# EAGLE design mint (EAGLE 6.4)
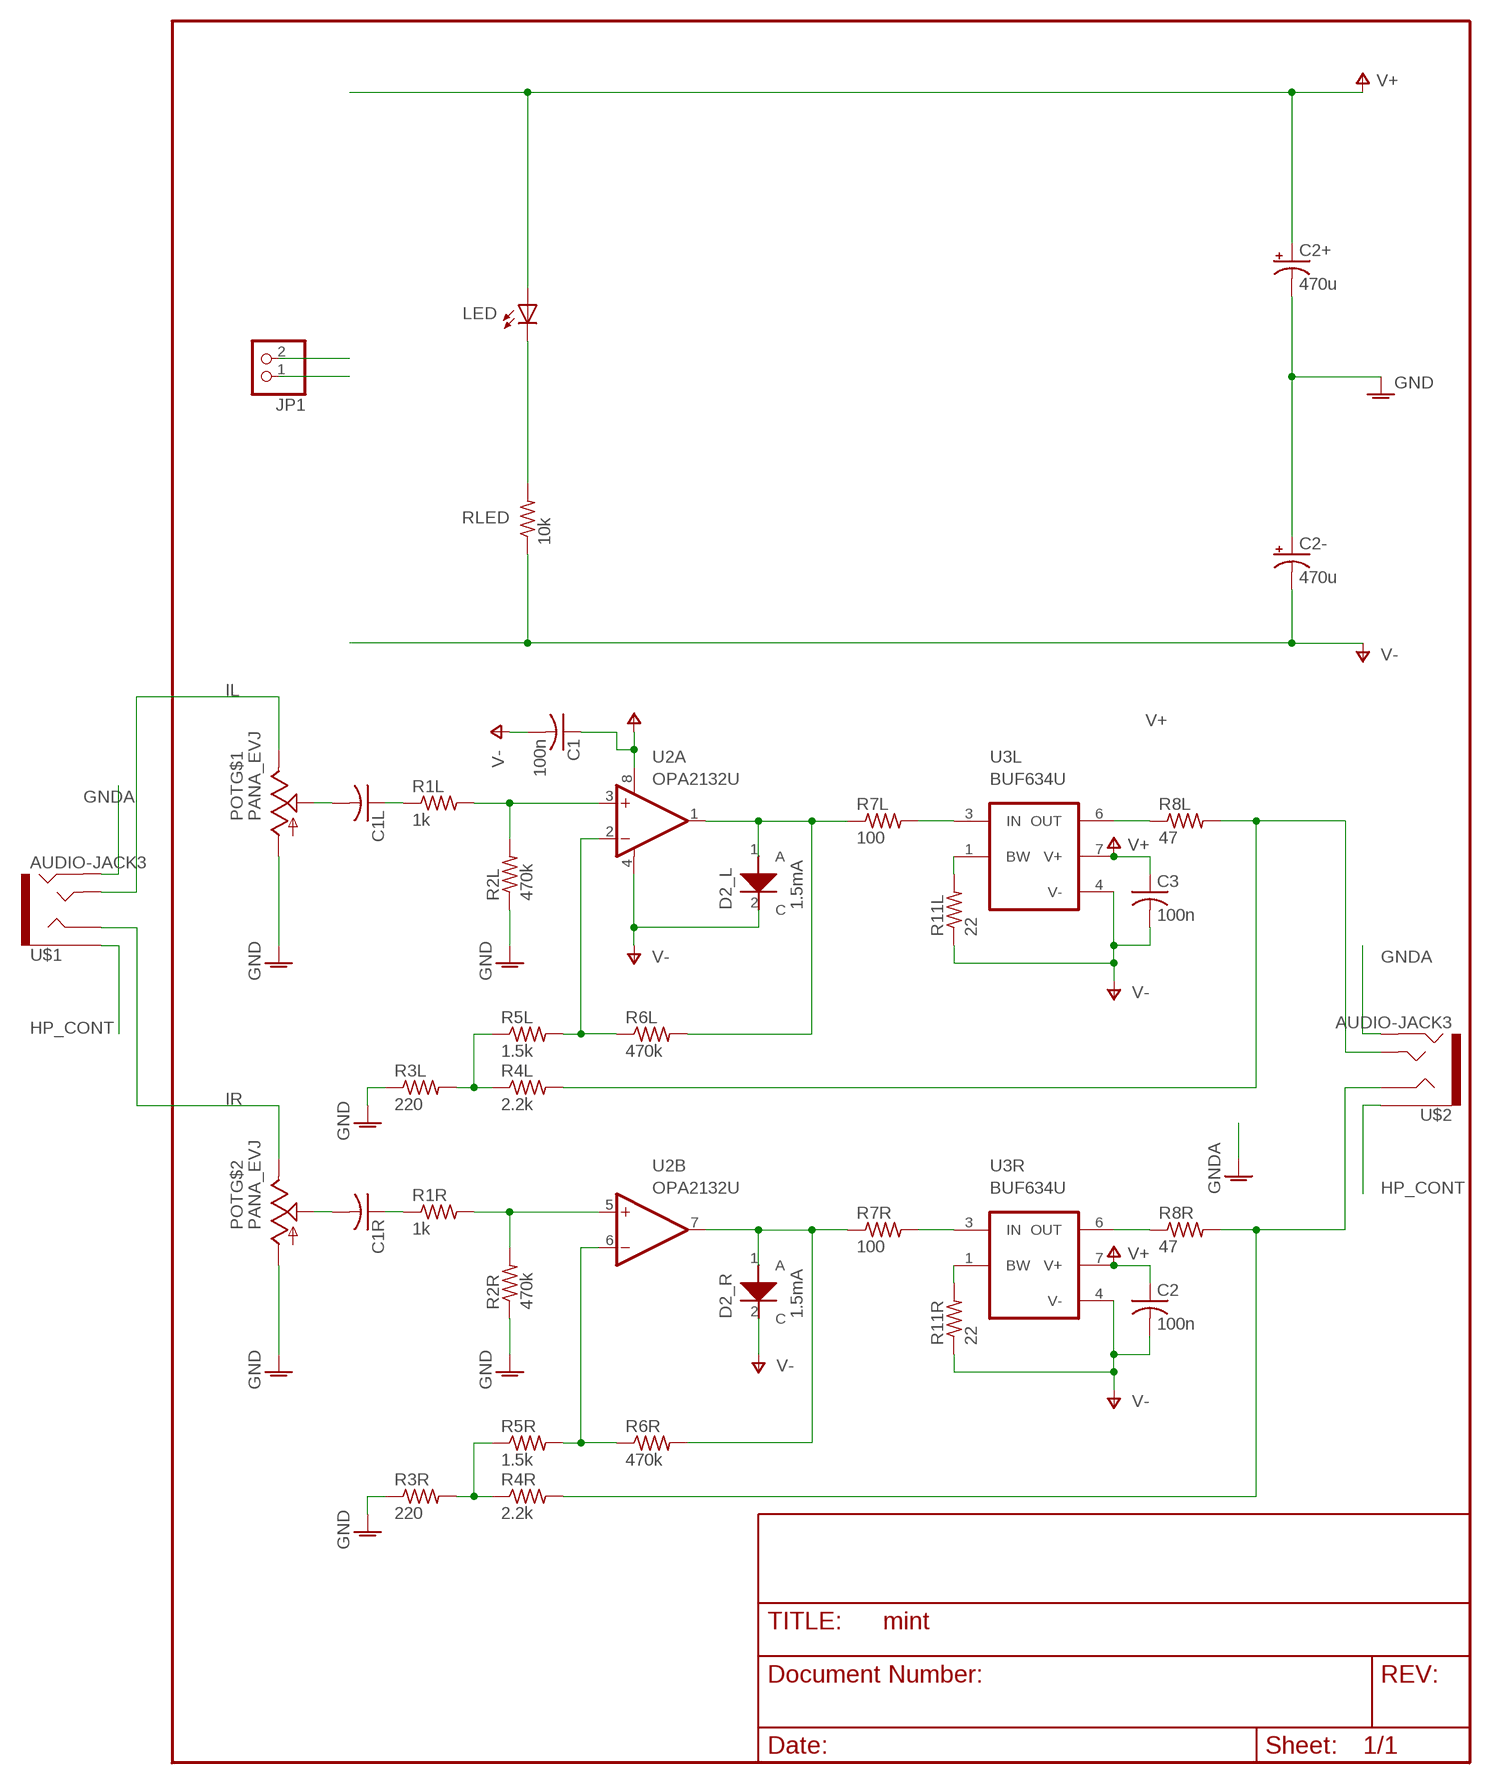
[diagram p0: schematic, sheet 1]

## Parts
C1  100n  C-USC0603  [C0603]
C1L  C-USC1210  [C1210]
C1R  C-USC1210  [C1210]
C2  100n  C-USC0603  [C0603]
C2+  470u  CPOL-USG  [PANASONIC_G]
C2-  470u  CPOL-USG  [PANASONIC_G]
C3  100n  C-USC0603  [C0603]
D2_L  S-152T  [SMD-2616]
D2_R  S-152T  [SMD-2616]
JP1  PINHD-1X2  [1X02]
LED  LEDCHIP-LED0603  [CHIP-LED0603]
POT  PANA_EVJ  ALPS_BLUE  [ALPS_RK27]
R1L  1k  R-US_R0603  [R0603]
R1R  1k  R-US_R0603  [R0603]
R2L  470k  R-US_R0603  [R0603]
R2R  470k  R-US_R0603  [R0603]
R3L  220  R-US_R0603  [R0603]
R3R  220  R-US_R0603  [R0603]
R4L  2.2k  R-US_R0603  [R0603]
R4R  2.2k  R-US_R0603  [R0603]
R5L  1.5k  R-US_R0603  [R0603]
R5R  1.5k  R-US_R0603  [R0603]
R6L  470k  R-US_R0603  [R0603]
R6R  470k  R-US_R0603  [R0603]
R7L  100  R-US_R0603  [R0603]
R7R  100  R-US_R0603  [R0603]
R8L  47  R-US_R0603  [R0603]
R8R  47  R-US_R0603  [R0603]
R11L  22  R-US_R0603  [R0603]
R11R  22  R-US_R0603  [R0603]
RLED  10k  R-US_R0603  [R0603]
U2  OPA2132U  [SO08]
U3L  BUF634U  [SO08]
U3R  BUF634U  [SO08]
U$1  AUDIO-JACK3  [AUDIO-JACK-TRRS-SMD]
U$2  AUDIO-JACK3  [AUDIO-JACK-TRRS-SMD]

## Nets
GNDA: C2+.- C2-.+ POT.G1 POT.G2 R2L.1 R2R.1 R3L.1 R3R.1 U$1.RING2 U$2.RING2 ; supply symbol labelled GND
HP_CONT: U$1.EARTH U$2.EARTH
IL: POT.I1 U$1.TIP
IR: POT.I2 U$1.RING1
N$1: JP1.2
N$2: JP1.1
N$3: C1L.1 R1L.1
N$4: LED.C RLED.2
N$5: R1L.2 R2L.2 U2.3(A:+IN)
N$6: R8L.1 U3L.6(OUT)
N$8: D2_L.1(A) R6L.2 R7L.1 U2.1(A:OUT)
N$11: R11L.2 U3L.1(BW)
N$12: R5L.2 R6L.1 U2.2(A:-IN)
N$13: R3L.2 R4L.1 R5L.1
N$14: R7L.2 U3L.3(IN)
N$15: C1L.2 POT.O1
N$18: C1R.1 R1R.1
N$19: R1R.2 R2R.2 U2.5(B:+IN)
N$21: D2_R.1(A) R6R.2 R7R.1 U2.7(B:OUT)
N$22: R8R.1 U3R.6(OUT)
N$23: R11R.2 U3R.1(BW)
N$25: R5R.2 R6R.1 U2.6(B:-IN)
N$26: R3R.2 R4R.1 R5R.1
N$27: R7R.2 U3R.3(IN)
N$28: C1R.2 POT.O2
OL: R4L.2 R8L.2 U$2.TIP
OR: R4R.2 R8R.2 U$2.RING1
V+: C1.1 C2+.+ C2.1 C3.1 LED.A U2.8(A:V+) U3L.7(V+) U3R.7(V+)
V-: C1.2 C2-.- C2.2 C3.2 D2_L.2(C) D2_R.2(C) R11L.1 R11R.1 RLED.1 U2.4(A:V-) U3L.4(V-) U3R.4(V-)

## Library data of the parts
C1 C1L C1R C2 C3 = rcl:C-US: CAPACITOR, American symbol
C2+ C2- = rcl:CPOL-US: POLARIZED CAPACITOR, American symbol
D2_L D2_R = semitec_diodes:S-152T
JP1 = pinhead:PINHD-1X2: PIN HEADER
LED = adafruit:LED: LED OSRAM: - CHIPLED LG R971, LG N971, LY N971, LG Q971, LY Q971, LO R971, LY R971 LH N974, LH R974 LS Q976, LO Q976, LY Q976 LO Q996 - Hyper CHIPLED LW Q18S LB Q993, LB Q99A, LB R99A - SideLED LS A670, LO A670, LY A670, LG A670, LP A670 LB A673, LV A673, LT A673, LW A673 LH A674 LY A675 LS A676, LA A676, LO A676, LY A676, LW A676 LS A679, LY A679, LG A679 - Hyper Micro SIDELED® LS Y876, LA Y876, LO Y876, LY Y876 LT Y87S - SmartLED LW L88C, LW L88S LB L89C, LB L89S, LG L890 LS L89K, LO L89K, LY L89K LS L896, LA L896, LO L896, LY L896 - TOPLED LS T670, LO T670, LY T670, LG T670, LP T670 LSG T670, LSP T670, LSY T670, LOP T670, LYG T670 LG T671, LOG T671, LSG T671 LB T673, LV T673, LT T673, LW T673 LH T674 LS T676, LA T676, LO T676, LY T676, LB T676, LH T676, LSB T676, LW T676 LB T67C, LV T67C, LT T67C, LS T67K, LO T67K, LY T67K, LW E67C LS E67B, LA E67B, LO E67B, LY E67B, LB E67C, LV E67C, LT E67C LW T67C LS T679, LY T679, LG T679 LS T770, LO T770, LY T770, LG T770, LP T770 LB T773, LV T773, LT T773, LW T773 LH T774 LS E675, LA E675, LY E675, LS T675 LS T776, LA T776, LO T776, LY T776, LB T776 LHGB T686 LT T68C, LB T68C - Hyper Mini TOPLED® LB M676 - Mini TOPLED Santana® LG M470 LS M47K, LO M47K, LY M47K Source: http://www.osram.convergy.de/
POT = audio-pots:ALPS_BLUE: Alps Blue potentiometer
R1L R1R R2L R2R R3L R3R R4L R4R R5L R5R R6L R6R R7L R7R R8L R8R R11L R11R RLED = rcl-2:R-US_: RESISTOR, American symbol
U2 = burr-brown:OPA2132: High Speed FET-Input Operational Amplifiers< Product Folder:OPA2132
U3L U3R = burr-brown:BUF634: 250mA High-Speed Buffer
U$1 U$2 = SparkFun-Connectors:AUDIO-JACK3: Audio jack - 3.5mm TRRS variety - two rings.

## Board
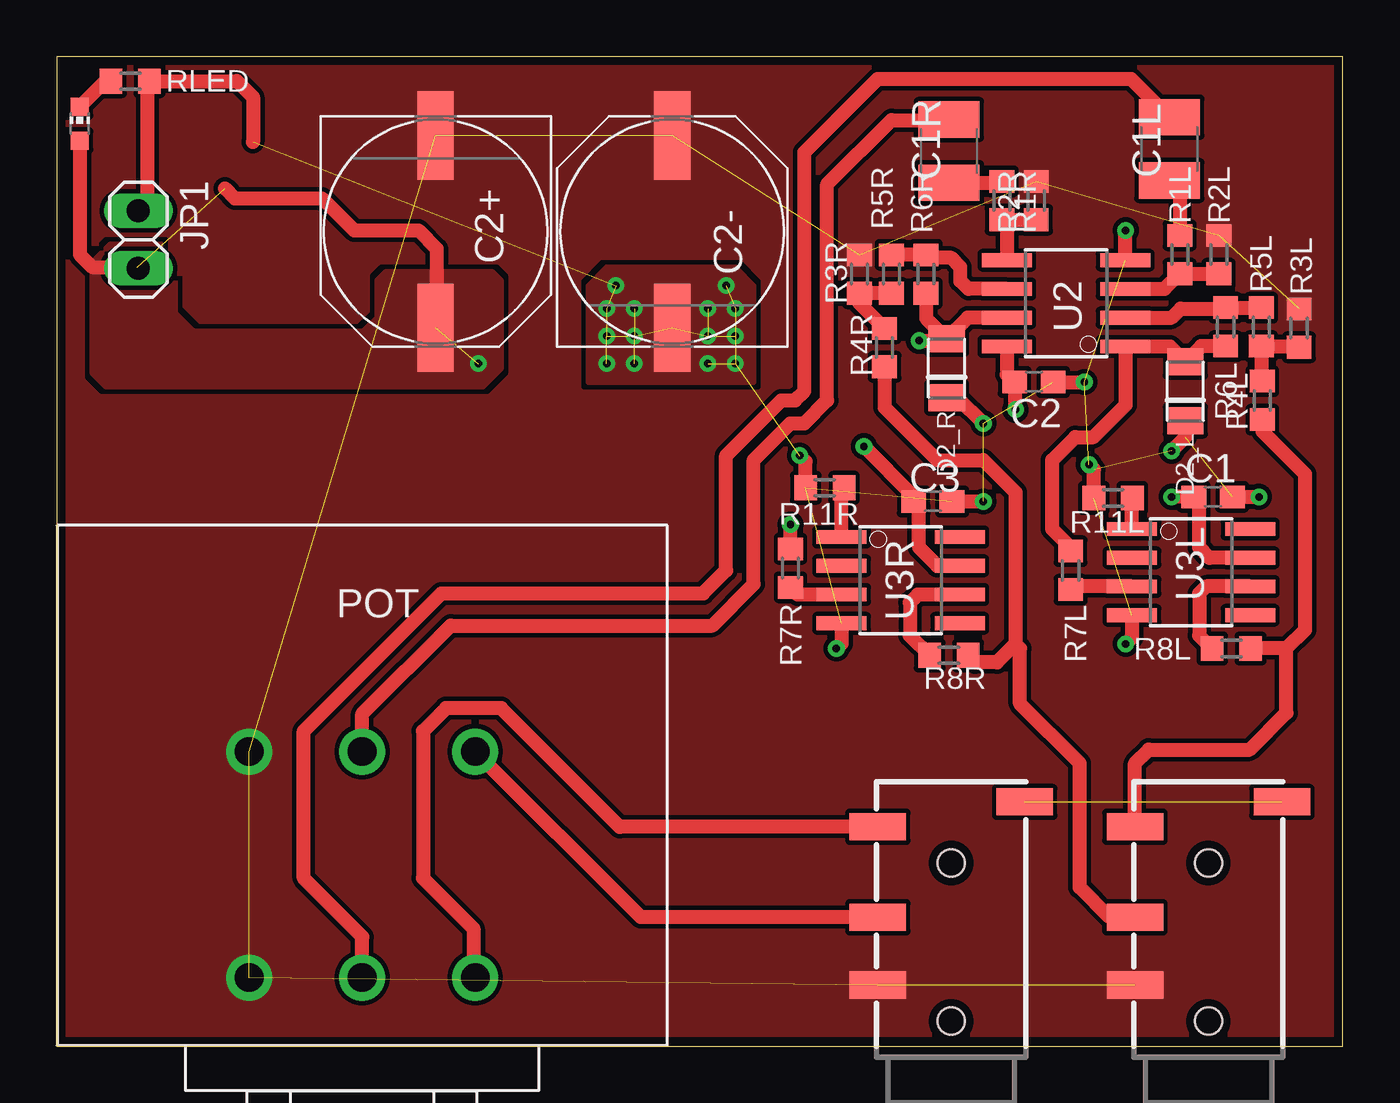
[diagram p1: board, top side]
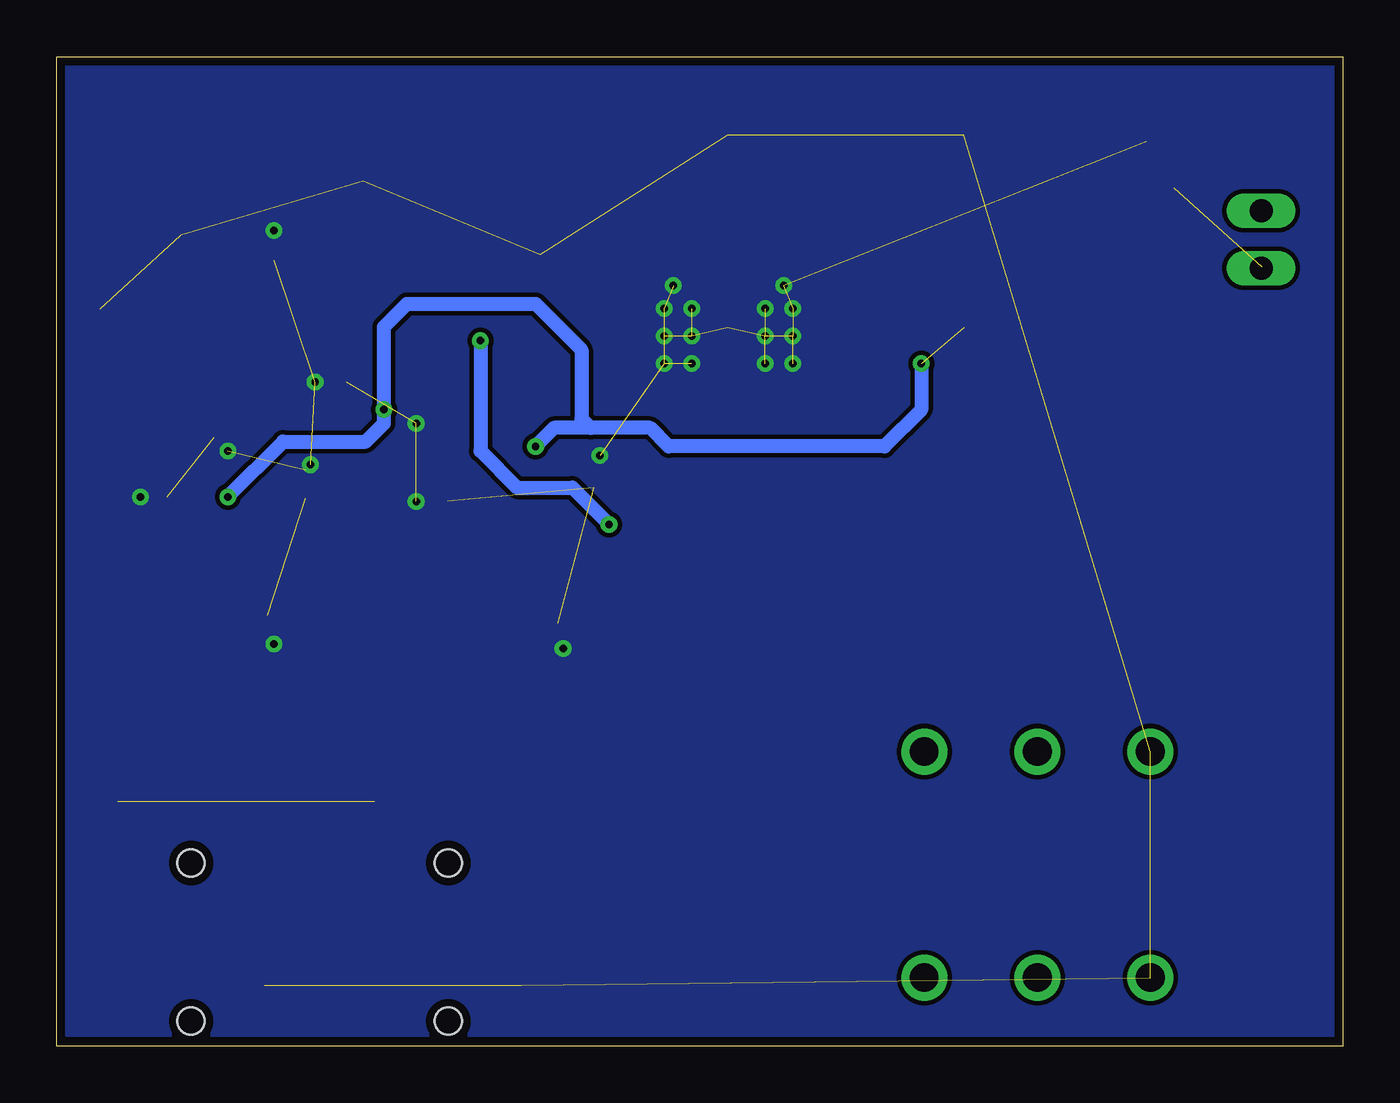
[diagram p2: board, bottom side, seen from below]

Size 56.92 x 43.78 mm. Coordinates in mm from the lower left corner, seen from the top.
Outline: 0,0 56.92,0 56.92,43.78 0,43.78 0,0
Copper layers (1*16): Top 0.035mm / dielectric 1.5mm / Bottom 0.035mm
Design rules "default *": minimum track width 10mil, minimum drill 24mil, track to track 8mil, track to pad 8mil, pad to pad 8mil, via to via 8mil, smd to smd 8mil, copper to edge 15mil, drill to drill 8mil, minimum pad ring 10mil, minimum via ring 8mil, stop-mask expansion 4mil, vias tented up to drill 0mil, thermal gap 10mil

### Footprints (pad centres in the part's own frame; a part is rotated, then mirrored left to right if it is on the bottom)
C0603 = smd 1.1 x 1: 1 -0.85,0; 2 0.85,0
C1210 = smd 1.6 x 2.7: 1 -1.4,0; 2 1.4,0
PANASONIC_G = smd 3.9 x 1.6: + 4.25,0; - -4.25,0
SMD-2616 = smd 1.6 x 1.2: 1 0,1.3; 2 0,-1.3
1X02 = drill 1.016 long: 1 -1.27,0; 2 1.27,0
CHIP-LED0603 = smd 0.8 x 0.8: A 0,-0.75; C 0,0.75
ALPS_RK27 = drill 1.27 pad 2.032: G1 5,4.5; G2 5,-5.5; I1 -5,4.5; I2 -5,-5.5; O1 0,4.5; O2 0,-5.5
R0603 = smd 1 x 1.1: 1 -0.85,0; 2 0.85,0
SO08 = smd 0.61 x 2.21: 1 -1.905,-2.616; 2 -0.635,-2.616; 3 0.635,-2.616; 4 1.905,-2.616; 5 1.905,2.616; 6 0.635,2.616; 7 -0.635,2.616; 8 -1.905,2.616
AUDIO-JACK-TRRS-SMD = smd 1.2 x 2.5: EARTH 11.3,-3.25; RING1 6.2,3.25; RING2 3.2,3.25; TIP 10.2,3.25 | hole 1.2: 1.6,0; 8.6,0

### Placement (x,y rotation side)
C1  51.17,24.3 0 top
C1L  49.24,39.7 90 top
C1R  39.48,39.59 90 top
C2  43.24,29.38 0 top
C2+  16.78,36.04 270 top
C2-  27.24,36.04 90 top
C3  38.77,24.1 0 top
D2_L  49.95,28.98 0 top
D2_R  39.38,29.99 0 top
JP1  3.62,35.68 270 top
LED  1.03,40.81 0 top
POT  13.53,7.54 180 top
R1L  49.7,35.02 270 top
R1R  41.82,37.41 270 top
R2L  51.42,35.02 270 top
R2R  43.35,37.41 270 top
R3L  54.98,31.77 270 top
R3R  35.52,34.16 270 top
R4L  53.35,28.57 270 top
R4R  36.64,30.91 270 top
R5L  53.3,31.82 90 top
R5R  36.94,34.16 90 top
R6L  51.73,31.82 270 top
R6R  38.47,34.16 270 top
R7L  44.87,21.05 270 top
R7R  32.47,21.15 270 top
R8L  51.98,17.6 0 top
R8R  39.48,17.29 0 top
R11L  46.75,24.25 0 top
R11R  34,24.71 0 top
RLED  3.26,42.69 180 top
U2  44.67,32.86 90 top
U3L  50.2,20.98 270 top
U3R  37.35,20.62 270 top
U$1  39.59,-0.49 90 top
U$2  50.97,-0.49 90 top

### Tracks (layer width: path | path; a pad name or v marks a point on that pad's centre or on a via)
GNDA  (9 unrouted)
  pour Top (rank 6, no thermals): 0.37,43.4 56.45,43.4 56.45,0.53 0.37,0.53
HP_CONT  (1 unrouted)
IL
  Top 0.61: U$1.TIP 24.92,9.71 19.67,14.96 17.23,14.96 16.22,13.94 16.22,7.44 18.45,5.2 18.45,3.11 POT.I1
IR
  Top 0.61: U$1.RING1 25.85,5.71 POT.I2
N$3
  Top 0.61: C1L.1 49.7,38.3 R1L.1
N$4
  Top 0.61: RLED.2 2.16,42.69 LED.C
N$5
  Top 0.61: R2L.2 R1L.2 49.02,33.5 U2.3
N$6
  Top 0.61: U3L.6 50.86,20.34 50.56,20.04 50.56,18.17 R8L.1
N$8
  Top 0.61: R6L.2 50.64,30.97 D2_L.1 49.27,30.96 U2.1 47.31,30.93 47.31,28.37 45.89,26.94 45.07,26.94 44.06,25.93 44.06,22.88 44.87,22.07 R7L.1
N$11
  Top 0.61: U3L.1 47.59,24.24 R11L.2
N$12
  Top 0.61: U2.2 49.34,32.23 49.75,32.63 51.69,32.63 R6L.1 R5L.2
N$13
  Top 0.61: R3L.2 54.93,30.97 R5L.1 53.3,29.47 R4L.1
N$14
  Top 0.61: U3L.3 45.01,20.34 R7L.2
N$15
  Top 0.61: POT.O1 13.53,4.85 10.94,7.44 10.94,13.94 17.03,20.04 28.61,20.04 29.63,21.05 29.63,26.13 32.07,28.57 32.68,28.57 33.08,28.98 33.08,39.54 36.34,42.79 47.54,42.79 C1L.2
N$18
  Top 0.61: C1R.1 41.82,38.19 R1R.1
N$19
  Top 0.61: R2R.2 R1R.2 42.05,36.56 U2.5
N$21  (via drill 0.33)
  Top 0.61: R6R.2 38.47,32.21 D2_R.1 | U2.7 40.32,32.23 D2_R.1 | v38.16,31.21 39.3,31.21 D2_R.1 | R7R.1 v32.47,23.08
  Bottom 0.61: v38.16,31.21 38.16,26.34 36.54,24.71 34.1,24.71 v32.47,23.08
N$22
  Top 0.61: U3R.6 38.11,19.98 37.76,19.63 37.76,18.17 R8R.1
N$23
  Top 0.61: U3R.1 34.73,24.6 R11R.2
N$25
  Top 0.61: U2.6 40.35,33.5 39.99,33.85 39.99,34.46 39.59,34.87 38.61,34.87 R6R.1 R5R.2
N$26
  Top 0.61: R5R.1 R3R.2 35.52,32.87 R4R.1
N$27
  Top 0.61: U3R.3 32.79,19.98 R7R.2
N$28
  Top 0.61: POT.O2 13.53,14.7 17.44,18.61 29.02,18.61 30.85,20.44 30.85,25.93 32.47,27.55 33.08,27.55 34.1,28.57 34.1,38.12 36.94,40.97 39.46,40.97 C1R.2
OL
  Top 0.61: R4L.2 53.35,27.2 55.23,25.32 55.23,18.41 54.42,17.6 | 54.42,17.6 R8L.2 | U$2.TIP 47.72,12.52 48.32,13.13 52.79,13.13 54.42,14.75 54.42,17.6
OR
  Top 0.61: R4R.2 36.64,28.27 38.98,25.93 41.01,25.93 42.43,24.51 42.43,17.8 | 42.43,17.8 41.62,16.99 40.64,16.99 R8R.2 | U$2.RING1 46.59,5.71 45.28,7.03 45.28,12.52 42.63,15.16 42.63,17.6 42.43,17.8
V+  (via drill 0.33)  (2 unrouted)
  Top 0.61: U2.8 42.05,29.73 C2.1 42.39,28.2 v42.43,28.16 | U3L.7 51.02,21.61 50.56,22.07 50.56,24.06 C1.1 v49.34,24.3 | U3R.7 38.98,21.25 38.16,22.07 38.16,23.86 C3.1 37.92,24.34 v35.73,26.54 | 7.46,37.94 7.89,37.51 11.75,37.51 13.17,36.09 16.02,36.09 16.83,35.28 16.83,31.84 C2+.+ | LED.A 1.03,35.02 1.59,34.46 3.57,34.46
  Bottom 0.61: v18.66,30.2 18.66,28.16 20.28,26.54 29.83,26.54 30.65,27.35 33.29,27.35 | 33.29,27.35 34.91,27.35 v35.73,26.54 | v49.34,24.3 46.9,26.74 43.24,26.74 42.43,27.55 v42.43,28.16 42.43,31.82 41.42,32.84 35.73,32.84 33.69,30.8 33.69,27.76 33.29,27.35
  pour Top (rank 5, no thermals): 3.62,35.48 2.4,35.48 1.59,34.67 1.59,29.79 2.2,29.18 18.86,29.18 19.67,29.99 19.67,33.85 19.27,34.26 14.59,34.26 14.19,33.85 14.19,32.23 13.58,31.62 6.06,31.62 5.25,32.43 5.25,34.87 4.64,35.48
V-  (via drill 0.33)  (25 unrouted)
  Top 0.61: C2.2 v45.48,29.38 | D2_R.2 39.87,28.69 v41.01,27.55 | C3.2 v41.01,24.1 | C1.2 v53.2,24.3 | U3R.4 34.73,17.83 v34.51,17.6 | U3L.4 47.59,18.08 v47.31,17.8 | R11L.1 45.9,25.51 v45.68,25.73 | R11R.1 33.15,25.86 v32.88,26.13 | U2.4 47.28,36.06 v47.31,36.09 | D2_L.2 49.95,26.94 v49.34,26.34 | 8.7,40 8.7,41.98 7.99,42.69 RLED.1 4.03,42.6 4.03,37.36
  other vias: 24.75,33.65 24.35,32.63 24.35,31.41 24.35,30.2 25.57,32.63 25.57,31.41 25.57,30.2 28.82,32.63 28.82,31.41 28.82,30.2 30.04,32.63 30.04,31.41 30.04,30.2 29.63,33.65
  pour Bottom (rank 6, no thermals): 0.37,43.4 56.45,43.4 56.45,0.53 0.37,0.53
  pour Top (rank 5, no thermals): 27.19,34.46 24.35,34.46 23.53,33.65 23.53,29.38 30.85,29.38 30.85,33.65 30.04,34.46